# EAGLE design H17R10 (EAGLE 9.6.2)

## Sheet 1 of 2: I/O parts
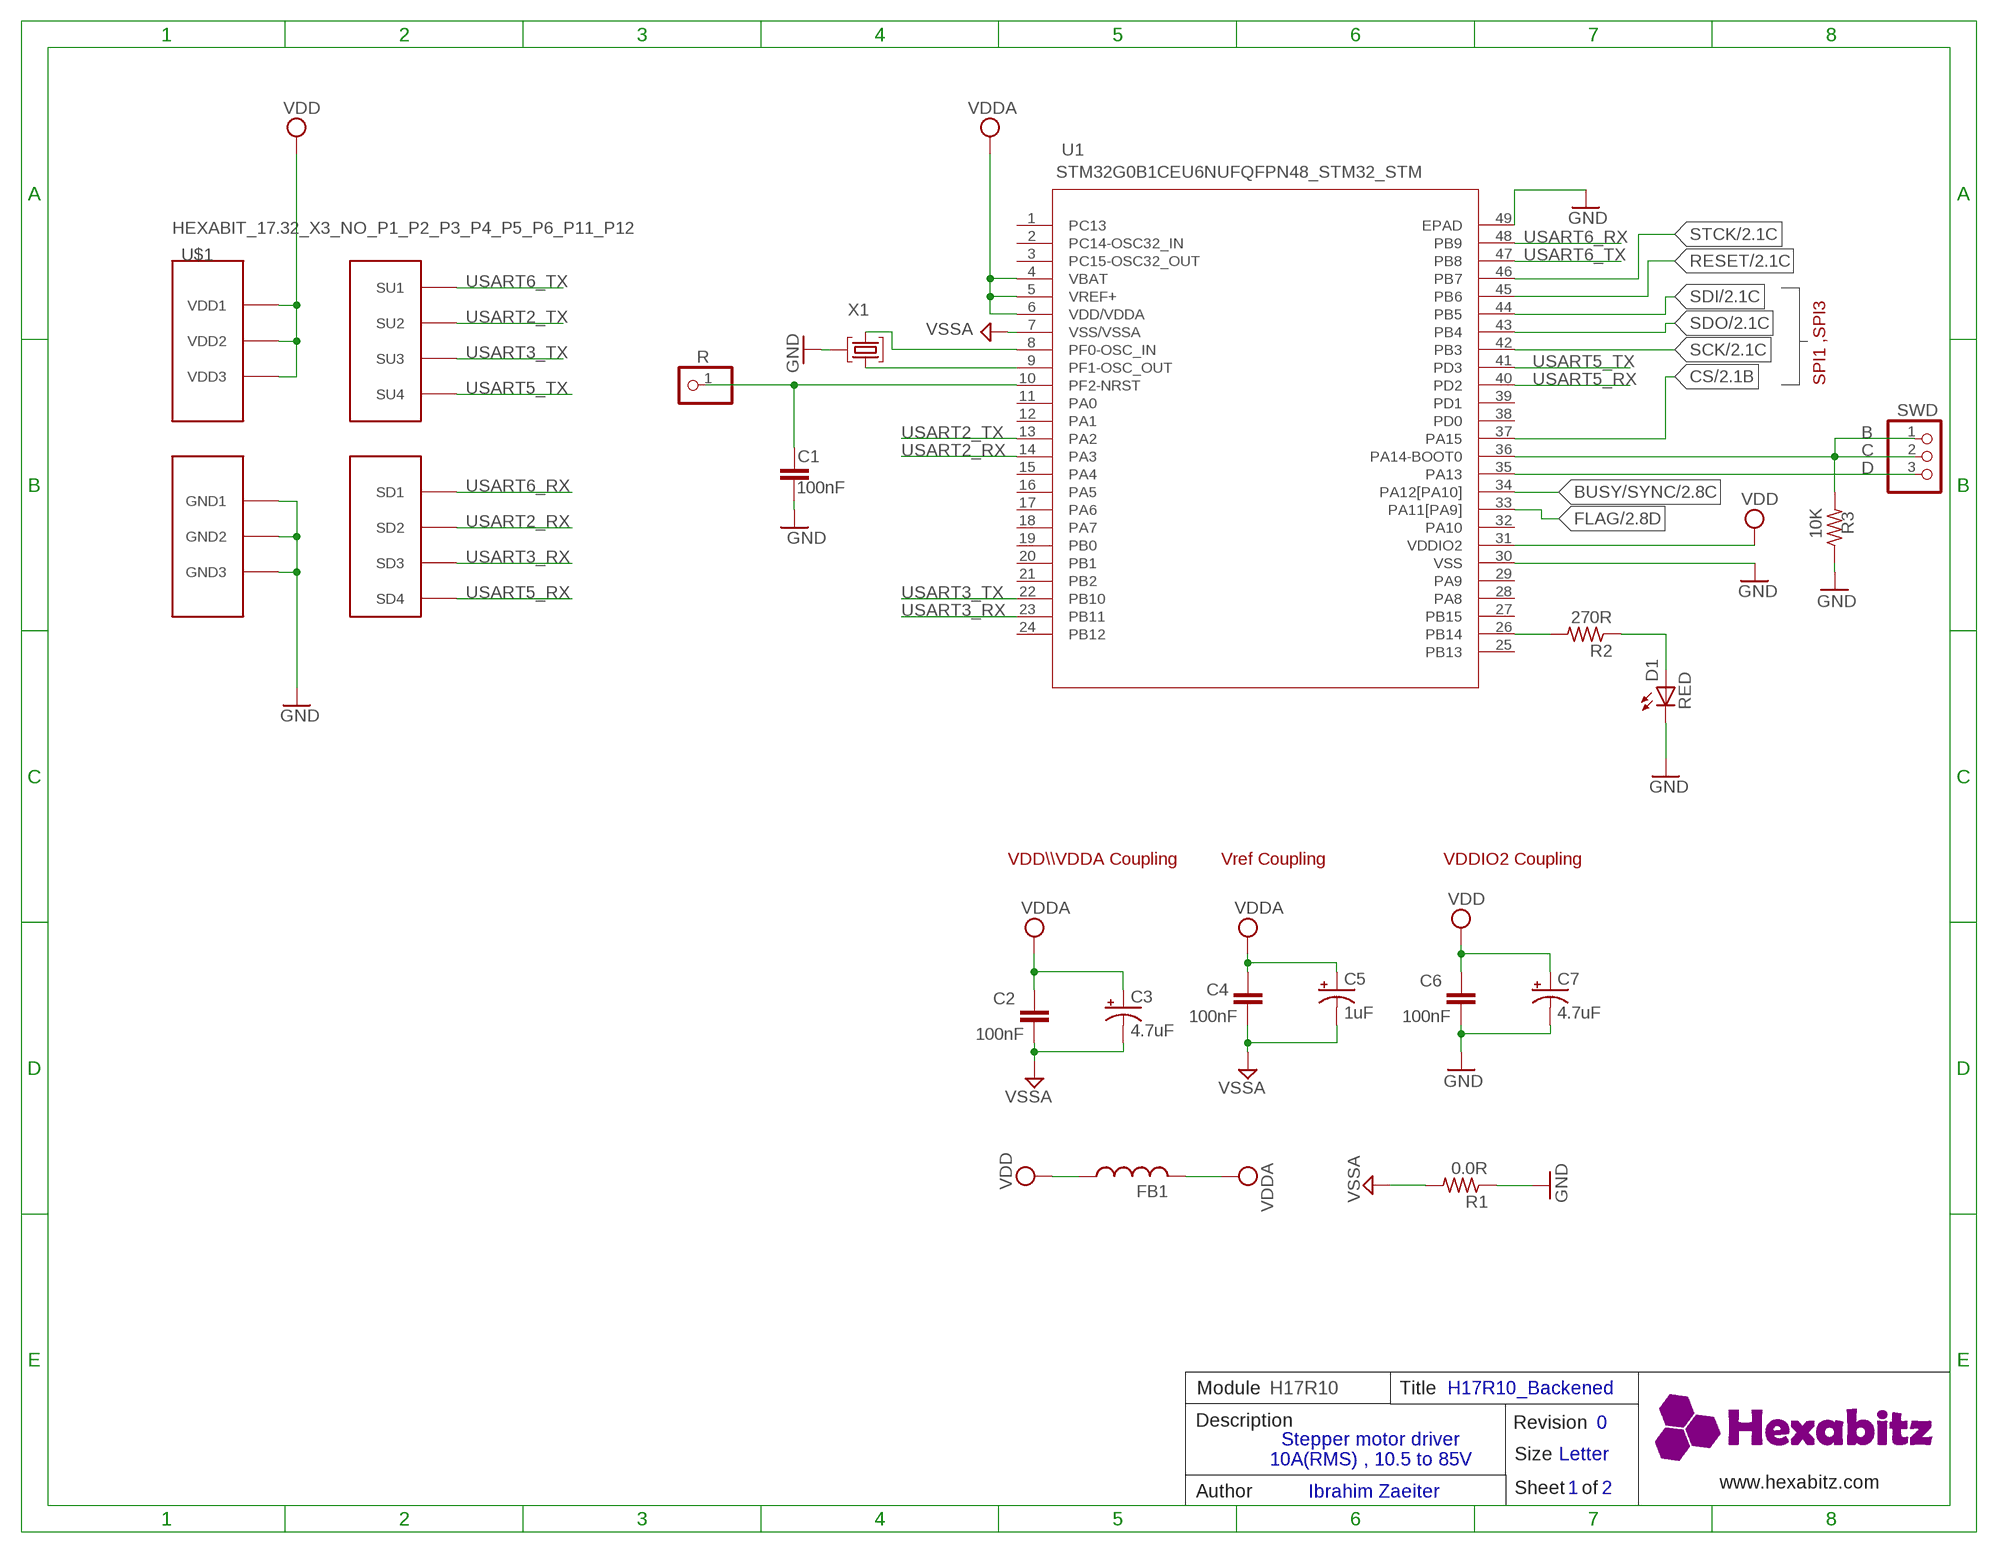
[diagram p0: schematic, sheet 1]

### Parts
C1  100nF  C-0603  [C-0603]
C2  100nF  C-0603  [C-0603]
C3  4.7uF  C-0805-POL  [C-0805-POL]
C4  100nF  C-0603  [C-0603]
C5  1uF  C-0805-POL  [C-0805-POL]
C6  100nF  C-0603  [C-0603]
C7  4.7uF  C-0805-POL  [C-0805-POL]
D1  RED  VLMS1300-GS08  [VLMS1300-GS08]
FB1  FB-TDK_MMZ1608Y300B  [FB-TDK_MMZ1608Y300B]
R  PINHD-1X1  [1X01]
R1  0.0R  R-0603  [R-0603]
R2  270R  R-0603  [R-0603]
R3  10K  R-0603  [R-0603]
SWD  PINHD-1X3  [1X03]
U1  STM32G0B1CEU6NUFQFPN48_STM32_STM  [HEXABITZ_ICS_UFQFPN48_STM32_STM]
U$1  HEXABIT_17.32_X3_NO_P1_P2_P3_P4_P5_P6_P11_P12  [HEXABIT_17.32_X3_NO_P1_P2_P3_P4_P5_P6_P11_P12]
X1  8MHZ  XTALL_CSTCE8M00G52  [XTALL_CSTCE8M00G52]

### Nets
BUSY/SYNC: U1.34(PA12[PA10]) ; also sheet 2
C: R3.2 SWD.1 SWD.2 U1.36(PA14-BOOT0)
CS: U1.37(PA15) ; also sheet 2
D: SWD.3 U1.35(PA13)
FLAG: U1.33(PA11[PA9]) ; also sheet 2
GND: C1.1 C6.1 C7.2(-) D1.C R1.1 R3.1 U1.30(VSS) U1.49(EPAD) U$1.PAD_PD12(GND1) U$1.PAD_PD17(GND2) U$1.PAD_PD19(GND3) X1.P$2
N$1: U1.8(PF0-OSC_IN) X1.P$1
N$2: U1.9(PF1-OSC_OUT) X1.P$3
N$12: C1.2 R.1 U1.10(PF2-NRST)
N$17: R2.2 U1.26(PB14)
N$19: D1.A R2.1
RESET: U1.45(PB6) ; also sheet 2
SCK: U1.42(PB3) ; also sheet 2
SDI: U1.44(PB5) ; also sheet 2
SDO: U1.43(PB4) ; also sheet 2
STCK: U1.46(PB7) ; also sheet 2
USART2_RX: U1.14(PA3) U$1.PAD_PD1(SD2)
USART2_TX: U1.13(PA2) U$1.PAD_PU1(SU2)
USART3_RX: U1.23(PB11) U$1.PAD_PD2(SD3)
USART3_TX: U1.22(PB10) U$1.PAD_PU2(SU3)
USART5_RX: U1.40(PD2) U$1.PAD_PD8(SD4)
USART5_TX: U1.41(PD3) U$1.PAD_PU8(SU4)
USART6_RX: U1.48(PB9) U$1.PAD_PD3(SD1)
USART6_TX: U1.47(PB8) U$1.PAD_PU3(SU1)
VDD: C6.2 C7.1(+) FB1.1 U1.31(VDDIO2) U$1.PAD_PU12(VDD1) U$1.PAD_PU17(VDD2) U$1.PAD_PU19(VDD3)
VDDA: C2.2 C3.1(+) C4.2 C5.1(+) FB1.2 U1.4(VBAT) U1.5(VREF+) U1.6(VDD/VDDA) ; also sheet 2
VSSA: C2.1 C3.2(-) C4.1 C5.2(-) R1.2 U1.7(VSS/VSSA) ; also sheet 2
Unconnected: U1.1(PC13) U1.2(PC14-OSC32_IN) U1.3(PC15-OSC32_OUT) U1.11(PA0) U1.12(PA1) U1.15(PA4) U1.16(PA5) U1.17(PA6) U1.18(PA7) U1.19(PB0) U1.20(PB1) U1.21(PB2) U1.24(PB12) U1.25(PB13) U1.27(PB15) U1.28(PA8) U1.29(PA9) U1.32(PA10) U1.38(PD0) U1.39(PD1)

### Notes on the sheet
- SPI1 ,SPI3
- B
- VDD\\\VDDA Coupling | Vref Coupling | VDDIO2 Coupling
- Module | H17R10 | Title | H17R10_Backened
- Description | Revision | 0
- Stepper motor driver 
  10A(RMS) , 10.5 to 85V
- Size | Letter
- www.hexabitz.com
- Author | Ibrahim Zaeiter | Sheet   of | 1 | 2

## Sheet 2 of 2
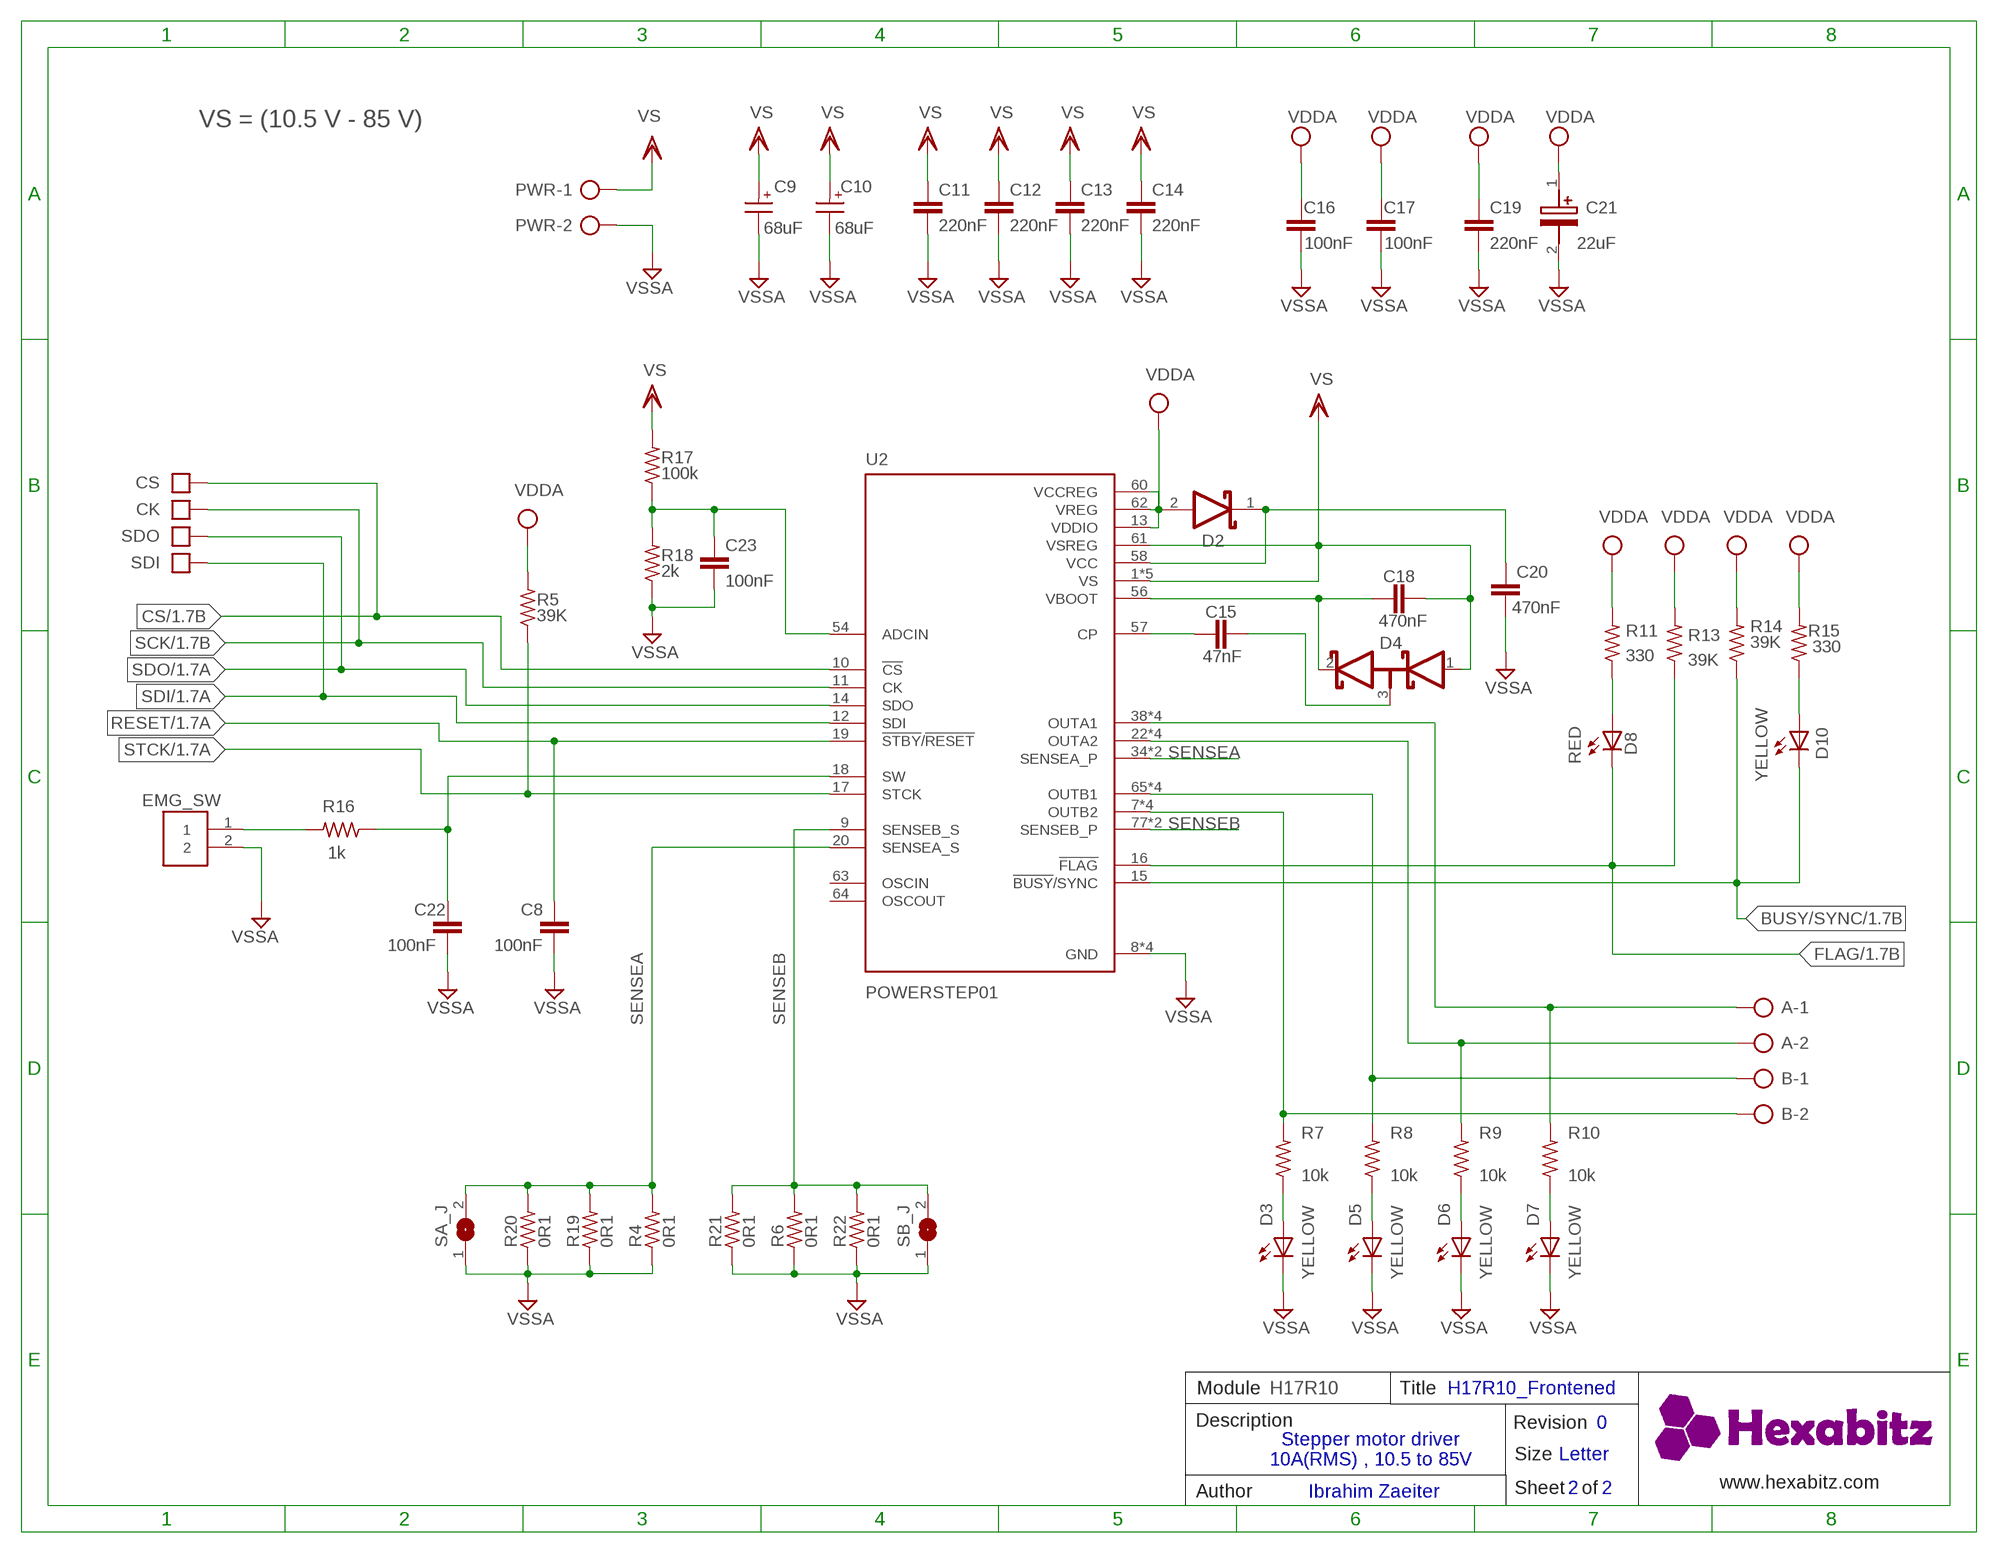
[diagram p1: schematic, sheet 2]

### Parts
A  AK500/2  [AK500/2]
B  AK500/2  [AK500/2]
C8  100nF  C-0603  [C-0603]
C9  68uF  WCAP-ASLI_12.5X14EEVFK2A680Q  [WCAP-ASLI_12.5X14(DXL)]
C10  68uF  WCAP-ASLI_12.5X14EEVFK2A680Q  [WCAP-ASLI_12.5X14(DXL)]
C11  220nF  C-0805  [C-0805]
C12  220nF  C-0805  [C-0805]
C13  220nF  C-0805  [C-0805]
C14  220nF  C-0805  [C-0805]
C15  47nF  C-0805  [C-0805]
C16  100nF  C-0603  [C-0603]
C17  100nF  C-0603  [C-0603]
C18  470nF  C-0603  [C-0603]
C19  220nF  C-0603  [C-0603]
C20  470nF  C-0603  [C-0603]
C21  22uF  T491A226K006AT  [T491A]
C22  100nF  C-0603  [C-0603]
C23  100nF  C-0603  [C-0603]
CK  PAD4  [PAD4]
CS  PAD4  [PAD4]
D2  STMICROELECTRONICS_BAT46ZFILMSTMICROELECTRONICS_BAT46ZFILM_0_3  [STMICROELECTRONICS_BAT46ZFILM_3]
D3  YELLOW  VLMY1300-GS08  [VLMY1300-GS08]
D4  STMICROELECTRONICS_BAR43SFILMSTMICROELECTRONICS_BAR43SFILM_0_0  [STMICROELECTRONICS_BAR43SFILM_0]
D5  YELLOW  VLMY1300-GS08  [VLMY1300-GS08]
D6  YELLOW  VLMY1300-GS08  [VLMY1300-GS08]
D7  YELLOW  VLMY1300-GS08  [VLMY1300-GS08]
D8  RED  VLMS1300-GS08  [VLMS1300-GS08]
D10  YELLOW  VLMY1300-GS08  [VLMY1300-GS08]
EMG_SW  3-644456-2  [TE_3-644456-2]
PWR  AK500/2  [AK500/2]
R4  0R1  R-US_R2512  [R2512]
R5  39K  R-0603  [R-0603]
R6  0R1  R-US_R2512  [R2512]
R7  10k  R-0805  [R-0805]
R8  10k  R-0805  [R-0805]
R9  10k  R-0805  [R-0805]
R10  10k  R-0805  [R-0805]
R11  330  R-0603  [R-0603]
R13  39K  R-0603  [R-0603]
R14  39K  R-0603  [R-0603]
R15  330  R-0603  [R-0603]
R16  1k  R-0603  [R-0603]
R17  100k  R-0603  [R-0603]
R18  2k  R-0603  [R-0603]
R19  0R1  R-US_R2512  [R2512]
R20  0R1  R-US_R2512  [R2512]
R21  0R1  R-US_R2512  [R2512]
R22  0R1  R-US_R2512  [R2512]
SA_J  SJW  [SJW]
SB_J  SJW  [SJW]
SDI  PAD4  [PAD4]
SDO  PAD4  [PAD4]
U2  POWERSTEP01  [IC_POWERSTEP01]

### Nets
BUSY/SYNC: D10.C R14.1 U2.15(!BUSY!/SYNC) ; also sheet 1
CS: CS.P$1 U2.10(!CS) ; also sheet 1
FLAG: D8.C R13.1 U2.16(!FLAG) ; also sheet 1
N$3: C22.1 R16.1 U2.18(SW)
N$4: C15.1 U2.57(CP)
N$5: D10.A R15.1
N$6: D7.A R10.1
N$7: C23.1 R17.1 R18.2 U2.54(ADCIN)
N$10: D3.A R7.1
N$13: D8.A R11.1
N$15: D5.A R8.1
N$16: D6.A R9.1
N$26: C18.2 D4.2(K1) U2.56(VBOOT)
N$27: C20.1 D2.1(CATHODE) U2.58(VCC)
N$32: C15.2 D4.3(A1/K2)
OUTA1: A.2 R10.2 U2.38(OUTA1) U2.42(OUTA1) U2.53(OUTA1) U2.EPAD4(OUTA1)
OUTA2: A.1 R9.2 U2.22(OUTA2) U2.33(OUTA2) U2.37(OUTA2) U2.EPAD3(OUTA2)
OUTB1: B.1 R8.2 U2.65(OUTB1) U2.76(OUTB1) U2.80(OUTB1) U2.EPAD7(OUTB1)
OUTB2: B.2 R7.2 U2.7(OUTB2) U2.81(OUTB2) U2.85(OUTB2) U2.EPAD8(OUTB2)
RESET: C8.1 U2.19(!STBY!/!RESET) ; also sheet 1
SCK: CK.P$1 U2.11(CK) ; also sheet 1
SDI: SDI.P$1 U2.12(SDI) ; also sheet 1
SDO: SDO.P$1 U2.14(SDO) ; also sheet 1
SENSEA: R4.2 R19.2 R20.2 SA_J.2 U2.20(SENSEA_S) U2.34(SENSEA_P) U2.39(SENSEA_P)
SENSEB: R6.2 R21.2 R22.2 SB_J.2 U2.9(SENSEB_S) U2.77(SENSEB_P) U2.82(SENSEB_P)
STCK: R5.1 U2.17(STCK) ; also sheet 1
SW: EMG_SW.1 R16.2
VDDA: C16.2 C17.2 C19.1 C21.1(+) D2.2(ANODE) R5.2 R11.2 R13.2 R14.2 R15.2 U2.13(VDDIO) U2.60(VCCREG) U2.62(VREG) ; also sheet 1
VS: C9.1(+) C10.1(+) C11.1 C12.1 C13.1 C14.1 C18.1 D4.1(A2) PWR.1 R17.2 U2.1(VS) U2.23(VS) U2.43(VS) U2.55(VS) U2.61(VSREG) U2.66(VS)
VSSA: C8.2 C9.2(-) C10.2(-) C11.2 C12.2 C13.2 C14.2 C16.1 C17.1 C19.2 C20.2 C21.2(-) C22.2 C23.2 D3.C D5.C D6.C D7.C EMG_SW.2 PWR.2 R4.1 R6.1 R18.1 R19.1 R20.1 R21.1 R22.1 SA_J.1 SB_J.1 U2.8(GND) U2.21(GND) U2.59(GND) U2.EPAD9(GND) ; also sheet 1
Unconnected: U2.63(OSCIN) U2.64(OSCOUT)

### Notes on the sheet
- VS = (10.5 V - 85 V)
- Module | H17R10 | Title | H17R10_Frontened
- Description | Revision | 0
- Stepper motor driver 
  10A(RMS) , 10.5 to 85V
- Size | Letter
- www.hexabitz.com
- Author | Ibrahim Zaeiter | Sheet   of | 2 | 2

## Library data of the parts
A B PWR = HEXABITZ_CONNECTION_PARTS:AK500/2: CONNECTOR; MFN: TE Connectivity; MPN: 282836-2; OCTOPART_URL: https://octopart.com/282836-2-te+connectivity-39396934?r=sp
C1 = HEXABITZ_RCLS:C-0603: CAP CER 10% X7R 0603; CAPACITANCE: 100nF; MFN: AVX CORPORATION; MPN: 0603YC104K4T2A; OCTOPART_URL: 'https://octopart.com/0603yc104k4t2a-avx+interconnect+%2F+elco-8120651; TOLERANCE: 10%; VOLTAGE_RATING: 16.0 V
C2 C4 C6 C16 C17 = HEXABITZ_RCLS:C-0603: CAP CER 10% X7R 0603; CAPACITANCE: 100nF; MFN: AVX CORPORATION; MPN: '0603YC104K4T2A; OCTOPART_URL: 'https://octopart.com/0603yc104k4t2a-avx+interconnect+%2F+elco-8120651; TOLERANCE: 10%; VOLTAGE_RATING: 16.0 V
C3 = HEXABITZ_RCLS:C-0805-POL: Cap Tant Solid SMD 2012; CAPACITANCE: 4.7uF; MFN: 'Panasonic; MPN: '10TPU4R7MSI; OCTOPART_URL: https://octopart.com/10tpu4r7msi-panasonic-29487748?r=sp; TOLERANCE: 20%; VOLTAGE_RATING: 10.0 V
C5 = HEXABITZ_RCLS:C-0805-POL: Cap Tant Solid SMD 2012; CAPACITANCE: 4.7uF; MFN: 'YAGEO [VA]; MPN: 'CC0805KKX7R7BB105; OCTOPART_URL: 'https://octopart.com/cc0805kkx7r7bb105-yageo-8376555?r=sp; TOLERANCE: 20%; VOLTAGE_RATING: 10.0 V
C7 = HEXABITZ_RCLS:C-0805-POL: Cap Tant Solid SMD 2012; CAPACITANCE: 1.00uF; MFN: 'Panasonic; MPN: '10TPU4R7MSI; OCTOPART_URL: https://octopart.com/10tpu4r7msi-panasonic-29487748?r=sp; TOLERANCE: 10%; VOLTAGE_RATING: 16.0 V
C8 C22 C23 = HEXABITZ_RCLS:C-0603: CAP CER 10% X7R 0603; CAPACITANCE: 100nF; MFN: TDK CORPORATION; MPN: C1608X7R1H104K080AA; OCTOPART_URL: https://octopart.com/c1608x7r1h104k080aa-tdk-25947665?r=sp
C9 C10 = HEXABITZ_RCLS:WCAP-ASLI_12.5X14: WCAP-ASLI Aluminium Electrolytic Capacitors Low Impedance +105 °C Characteristics Low impedance product series Mounting style: V-Chip SMT Capacitance range: 0.1 µF ‒ 6800 µF Capacitance tolerance: ±20 % Voltage range (UR): 6.3 ‒ 100 V(DC) Operating temperature: -55 °C up to +105 °C Endurance: 2000 h @ +105 °C Dimensions (DxL) in mm: 4.0 x 5.5 up to 16.0 x 17.0 Recommended soldering: Reflow soldering Applications Low impedance, especially for filtering applications Input and output capacitor for switched-mode power supply Filtering Smoothing e.g. DC/DC converter, AC/DC converter, satellite receiver, control panel <https://www.we-online.com/catalog/media/o14723v209%20Family_WCAP-ASLI.jpg> Details see: https://www.we-online.com/catalog/en/WCAP-ASLI/ Updated by yingchun,Shan;2020-03-03 2020(C) Würth Elektronik; MFN: Panasonic; MPN: EEVFK2A680Q; OCTOPART_URL: https://octopart.com/eevfk2a680q-panasonic-2421317?r=sp
C11-C14 = HEXABITZ_RCLS:C-0805: CAP CER 10% X7R 0805
C15 = HEXABITZ_RCLS:C-0805: CAP CER 10% X7R 0805; MFN: KEMET; MPN: C0805C473K1RACTU; OCTOPART_URL: https://octopart.com/c0805c473k1ractu-kemet-12557765?r=sp; VOLTAGE_RATING: 100V
C18 C20 = HEXABITZ_RCLS:C-0603: CAP CER 10% X7R 0603; MFN: TDK; MPN: CGA3E3X7R1E474K080AE; OCTOPART_URL: https://octopart.com/search?q=CAP+CER+470nF+25V+X7R+0603&currency=USD&specs=0; VOLTAGE_RATING: 100V
C19 = HEXABITZ_RCLS:C-0603: CAP CER 10% X7R 0603; MFN: TDK; MPN: CGA3E3X7R1V224K080AE; OCTOPART_URL: https://octopart.com/cga3e3x7r1v224k080ae-tdk-68305867?r=sp
C21 = HEXABITZ_RCLS:T491A226K006AT: T491, Tantalum, MnO2 Tantalum, Commercial Grade, 22 uF, 10%, 6.3 VDC, 125C, -55C, 85C, SMD, MnO2, Molded, 6 % , 3 Ohms, 1400 nA, 58.6 mg, 3216, 1.6mm, Height Max = 1.8mm, 2000, 156 Weeks Source: Datasheet <https://content.kemet.com/datasheets/KEM_T2005_T491.pdf>; DESCRIPTION: T491, Tantalum, MnO2 Tantalum, Commercial Grade, 22 uF, 10%, 6.3 VDC, 125C, -55C, 85C, SMD, MnO2, Molded, 6 % , 3 Ohms, 1400 nA, 58.6 mg, 3216, 1.6mm, Height Max = 1.8mm, 2000, 156 Weeks; HEIGHT: 1.8mm; MANUFACTURER_NAME: KEMET; MANUFACTURER_PART_NUMBER: T491A226K006AT; MOUSER_PART_NUMBER: 80-T491A226K006; MOUSER_PRICE-STOCK: https://www.mouser.co.uk/ProductDetail/KEMET/T491A226K006AT/?qs=JDkBW2j1Xl8SBbKDtMTqWA%3D%3D
CK CS SDI SDO = HEXABITZ_CONNECTION_PARTS:PAD4
D1 = HEXABITZ_USER_INTERFACE_PARTS:VLMS1300-GS08: Red 0603 130° Clear 54 mcd 2 V Surface Mount ChipLED ; Octopart Url : http://octopart.com/vlms1300-gs08-vishay-21709201; MFN: Vishay; MPN: VLMS1300-GS08; OCTOPART_URL: https://octopart.com/vlms1300-gs08-vishay-21709201?r=sp&s=0nXJNjGsSbWwqfqWlZv0EA
D2 = HEXABITZ_RCLS:STMICROELECTRONICS_BAT46ZFILM: DIODE SCHOTTKY 100V 150MA SOD123; DESCRIPTION: Small Signal Diode, 100 V, 150 Ma, 1 V, 1 A Rohs Compliant: Yes; MFN: STMicroelectronics; MPN: BAT46ZFILM; OCTOPART_URL: https://octopart.com/bat46zfilm-stmicroelectronics-658190?r=sp
D3 D5-D7 D10 = HEXABITZ_USER_INTERFACE_PARTS:VLMY1300-GS08: Yellow 0603 130° Clear 54 mcd 2 V Surface Mount ChipLED ; Octopart Url : http://octopart.com/vlmy1300-gs08-vishay-21709201; MFN: Lite-On; MPN: LTST-C170YKT; OCTOPART_URL: https://octopart.com/ltst-c170ykt-lite-on-549813?r=sp
D4 = HEXABITZ_RCLS:STMICROELECTRONICS_BAR43SFILM: DIODE ARRAY SCHOTTKY 30V SOT23-3; MFN: STMicroelectronics; MPN: BAR43SFILM; OCTOPART_URL: https://octopart.com/bar43sfilm-stmicroelectronics-39549077?r=sp
D8 = HEXABITZ_USER_INTERFACE_PARTS:VLMS1300-GS08: Red 0603 130° Clear 54 mcd 2 V Surface Mount ChipLED ; Octopart Url : http://octopart.com/vlms1300-gs08-vishay-21709201; MFN: Lite-On; MPN: LTST-C170-EKT; OCTOPART_URL: https://octopart.com/ltst-c170ekt-lite-on-549816?r=sp
EMG_SW = HEXABITZ_USER_INTERFACE_PARTS:3-644456-2; AVAILABILITY: Unavailable; CENTERLINE_PITCH: 2.54 mm[.1 in]; COMMENT: 3-644456-2; DESCRIPTION: Connector Unshrouded Header HDR 2 Position 2.54mm Solder Straight Thru-Hole; EU_ROHS_COMPLIANCE: Compliant; MF: TE Connectivity; MFN: TE Connectivity; MP: 3-644456-2; MPN: 87224-1; NUMBER_OF_POSITIONS: 2; OCTOPART_URL: https://octopart.com/87224-1-te+connectivity-39512011?r=sp; PACKAGE: None; PRICE: None; PRODUCT_TYPE: Connector; TE_PURCHASE_URL: https://www.te.com/usa-en/product-3-644456-2.html?te_bu=Cor&te_type=disp&te_campaign=seda_glo_cor-seda-global-disp-prtnr-fy19-seda-model-bom-cta_sma-317_1&elqCampaignId=32493
FB1 = HEXABITZ_RCLS:FB-TDK_MMZ1608Y300B: Ferrite Beads Multi-Layer 30Ohm 25% 100MHz 1.5A 50mOhm DCR 0603; MFN: TDK; MPN: MMZ1608Y300BTA00; OCTOPART_URL: https://octopart.com/mmz1608y300bta00-tdk-7906990?r=sp
R = HEXABITZ_USER_INTERFACE_PARTS:PINHD-1X1: PIN HEADER; MFN: TE Connectivity; MPN: 87227-1; OCTOPART_URL: https://octopart.com/87227-1-te+connectivity-39512052?r=sp
R1 = HEXABITZ_RCLS:R-0603: Thick Film Resistors - SMD 0603; MFN: YAGEO [VR]; MPN: RC0603JR-070RL; OCTOPART_URL: https://octopart.com/rc0603jr-070rl-yageo-1241539?r=sp; RESISTANCE: 0R
R2 = HEXABITZ_RCLS:R-0603: Thick Film Resistors - SMD 0603; MFN: 'Panasonic; MPN: 'ERJ-3GEYJ271V; OCTOPART_URL: https://octopart.com/erj-3geyj271v-panasonic-55560546?r=sp; RESISTANCE: 270R
R3 = HEXABITZ_RCLS:R-0603: Thick Film Resistors - SMD 0603; MFN: Vishay; MPN: '060300J0103T5E; OCTOPART_URL: https://octopart.com/search?q=060300J0103T5E&currency=USD&specs=0; RESISTANCE: 10K
R4 R6 R19-R22 = HEXABITZ_RCLS:R-US_: RESISTOR, American symbol; MFN: Yageo; MPN: PE2512FKE7W0R1L; OCTOPART_URL: https://octopart.com/pe2512fke7w0r1l-yageo-71384148?r=sp; SPICEPREFIX: R
R5 R13 R14 R17 R18 = HEXABITZ_RCLS:R-0603: Thick Film Resistors - SMD 0603; MFN: Yageo; MPN: RC0603FR-0739KL; OCTOPART_URL: https://octopart.com/rc0603fr-0739kl-yageo-55402883?r=sp; RESISTANCE: 39K
R7-R10 = HEXABITZ_RCLS:R-0805: Thick Film Resistors - SMD 0605; MFN: Panasonic; MPN: ERJ-6GEYJ103V; OCTOPART_URL: https://octopart.com/erj-6geyj103v-panasonic-55422885?r=sp
R11 R15 R16 = HEXABITZ_RCLS:R-0603: Thick Film Resistors - SMD 0603; MFN: Yageo; MPN: RC0603JR-07330RL; OCTOPART_URL: https://octopart.com/rc0603jr-07330rl-yageo-39803615?r=sp; RESISTANCE: 330
SA_J SB_J = jumper:SJ: SMD solder JUMPER
SWD = pinhead:PINHD-1X3: PIN HEADER
U1 = HEXABITZ_ICs:STM32G0B1CEU6N; COPYRIGHT: Copyright (C) 2022 Ultra Librarian. All rights reserved.; MFN: STMicroelectronics; MPN: STM32G0B1CEU6N; OCTOPART_URL: https://octopart.com/stm32g0b1ceu6n-stmicroelectronics-116364672?r=sp
U2 = POWERSTEP01:POWERSTEP01: powerSTEP01 Series 5V 10A System-in-Package Integrating Microstepping Controller Check availability <https://pricing.snapeda.com/parts/POWERSTEP01/STMicroelectronics/view-part?ref=eda>; AVAILABILITY: In Stock; DESCRIPTION: Bipolar Motor Driver Power MOSFET SPI 89-VFQFPN (11x14); MF: STMicroelectronics; MP: POWERSTEP01; PACKAGE: PowerVFQFN-89 STMicroelectronics; PRICE: None; PURCHASE-URL: https://pricing.snapeda.com/search/part/POWERSTEP01/?ref=eda
U$1 = hexabitz_connectors:HEXABIT_17.32_X3_NO_P1_P2_P3_P4_P5_P6_P11_P12
X1 = HEXABITZ_OTHER_PARTS:XTALL_CSTCE8M00G52: MURATA CSTCE8M00G52-R0 RESONATOR, SMD, 8MHZ ; Octopart Url : https://octopart.com/cstce8m00g52-r0-murata-7145559; MFN: Murata; MPN: CSTNE8M00G550000R0; OCTOPART_URL: https://octopart.com/cstne8m00g550000r0-murata-91406934?r=sp

## Board
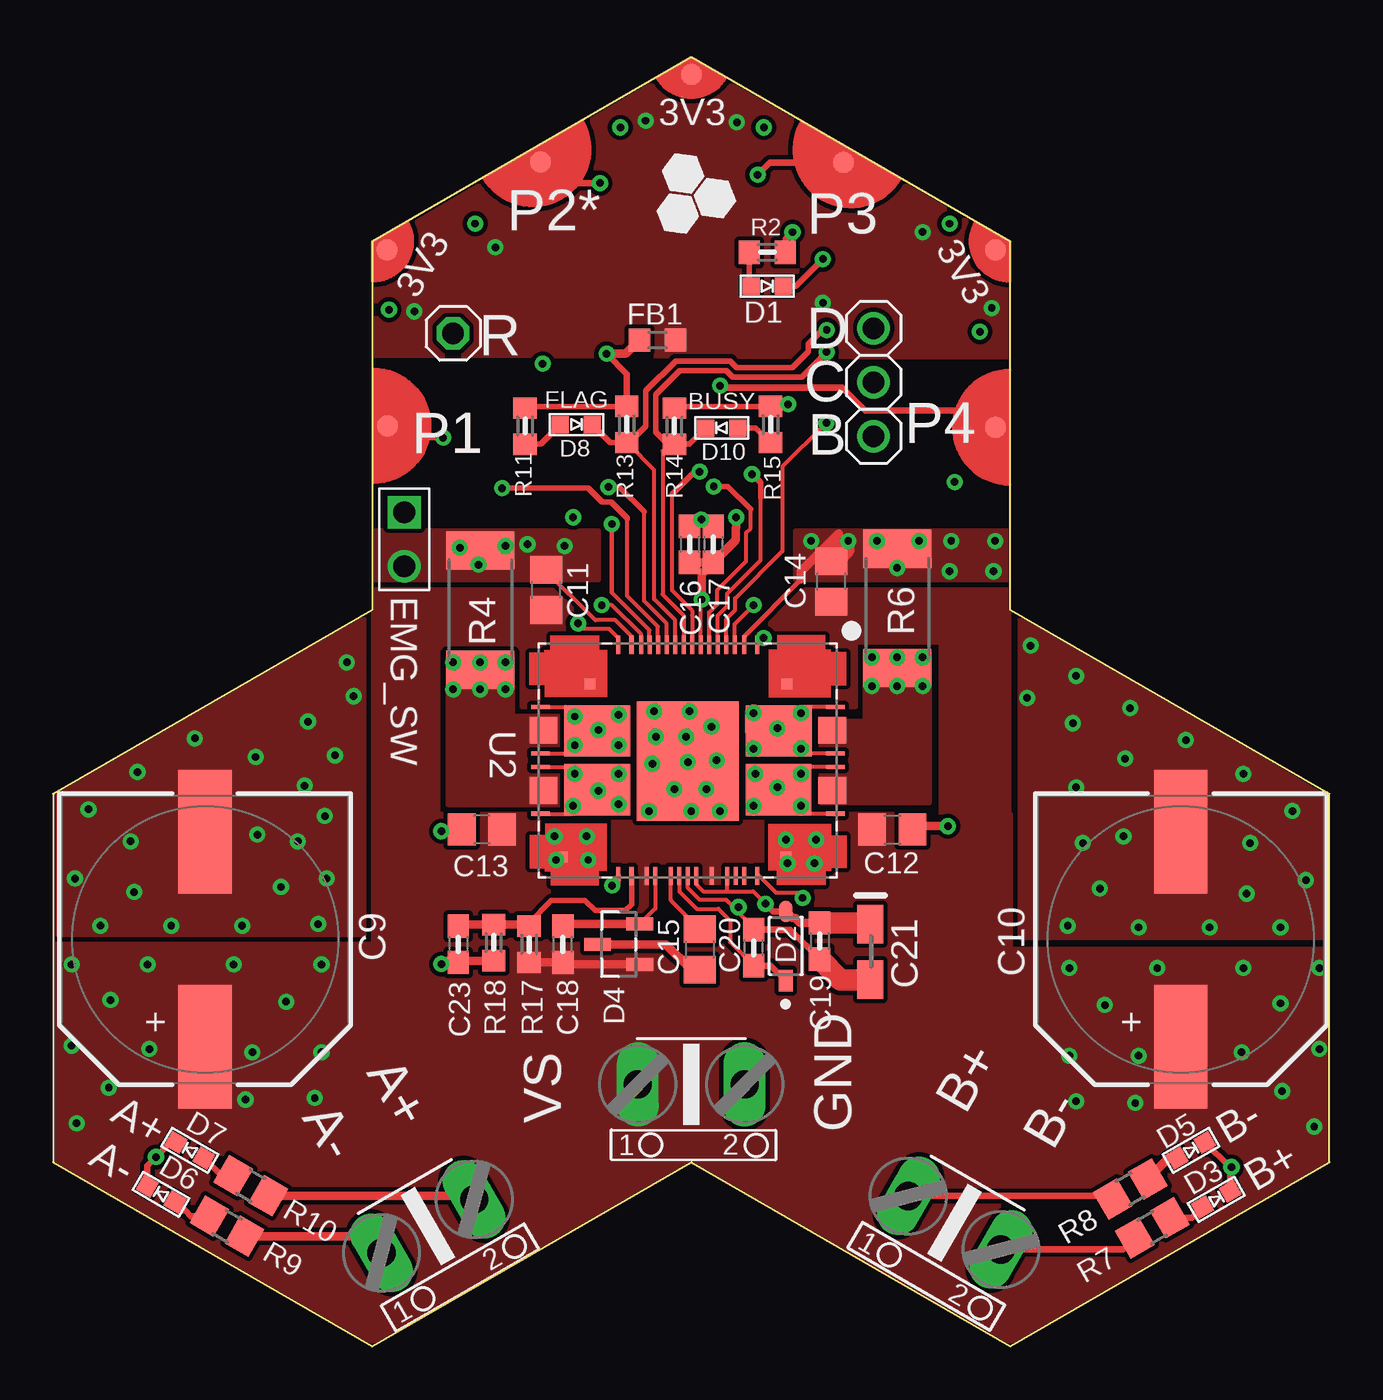
[diagram p2: board, top side]
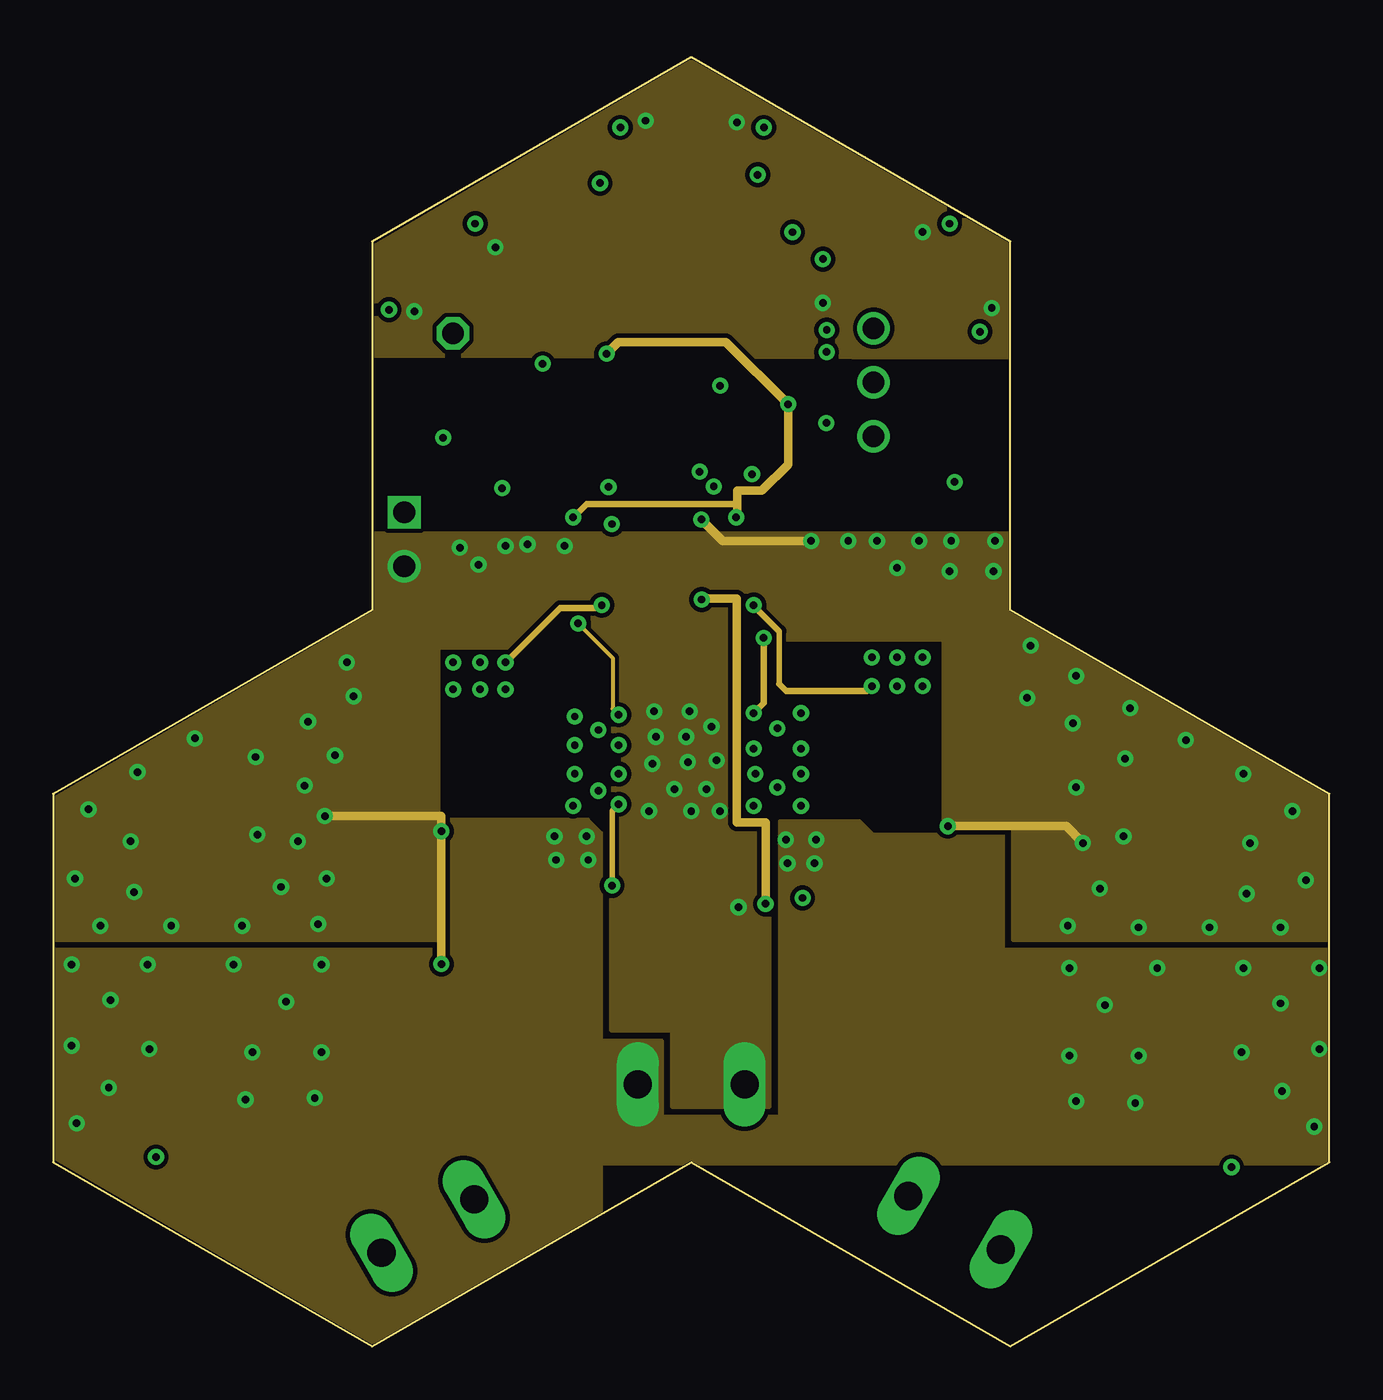
[diagram p3: board, inner layer Route2]
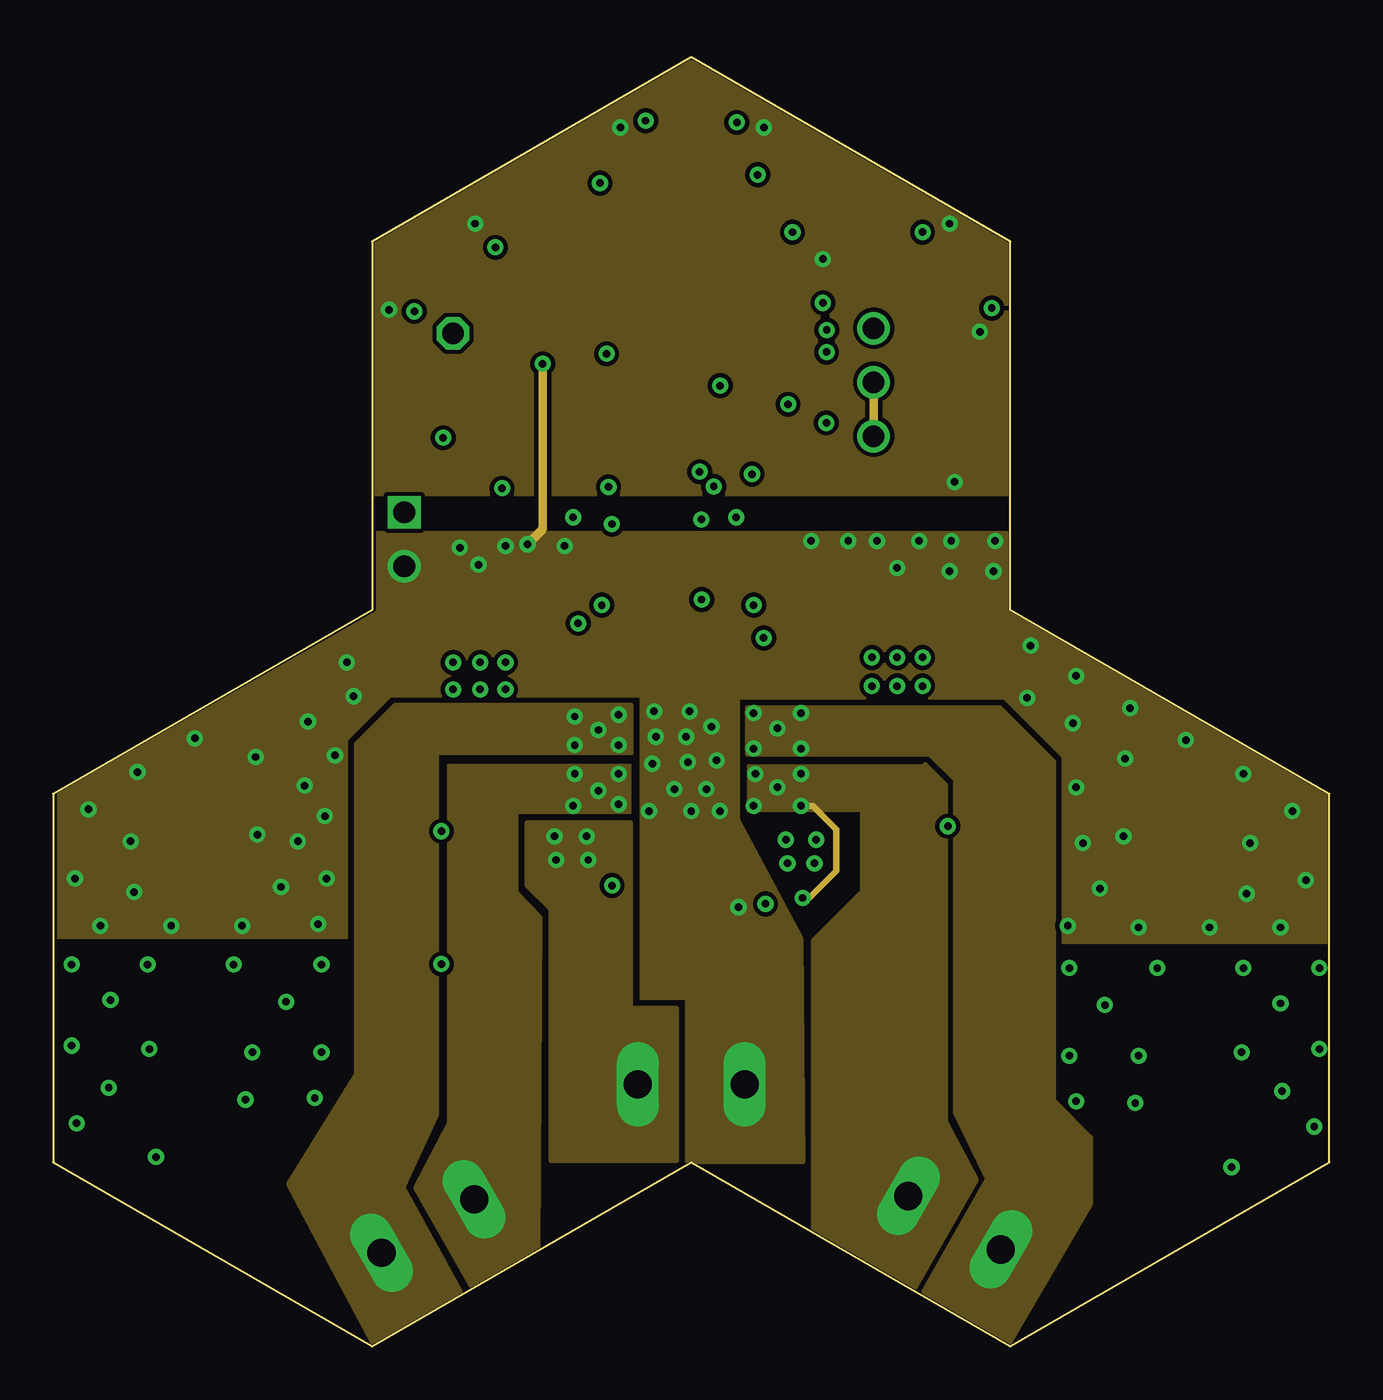
[diagram p4: board, inner layer Route15]
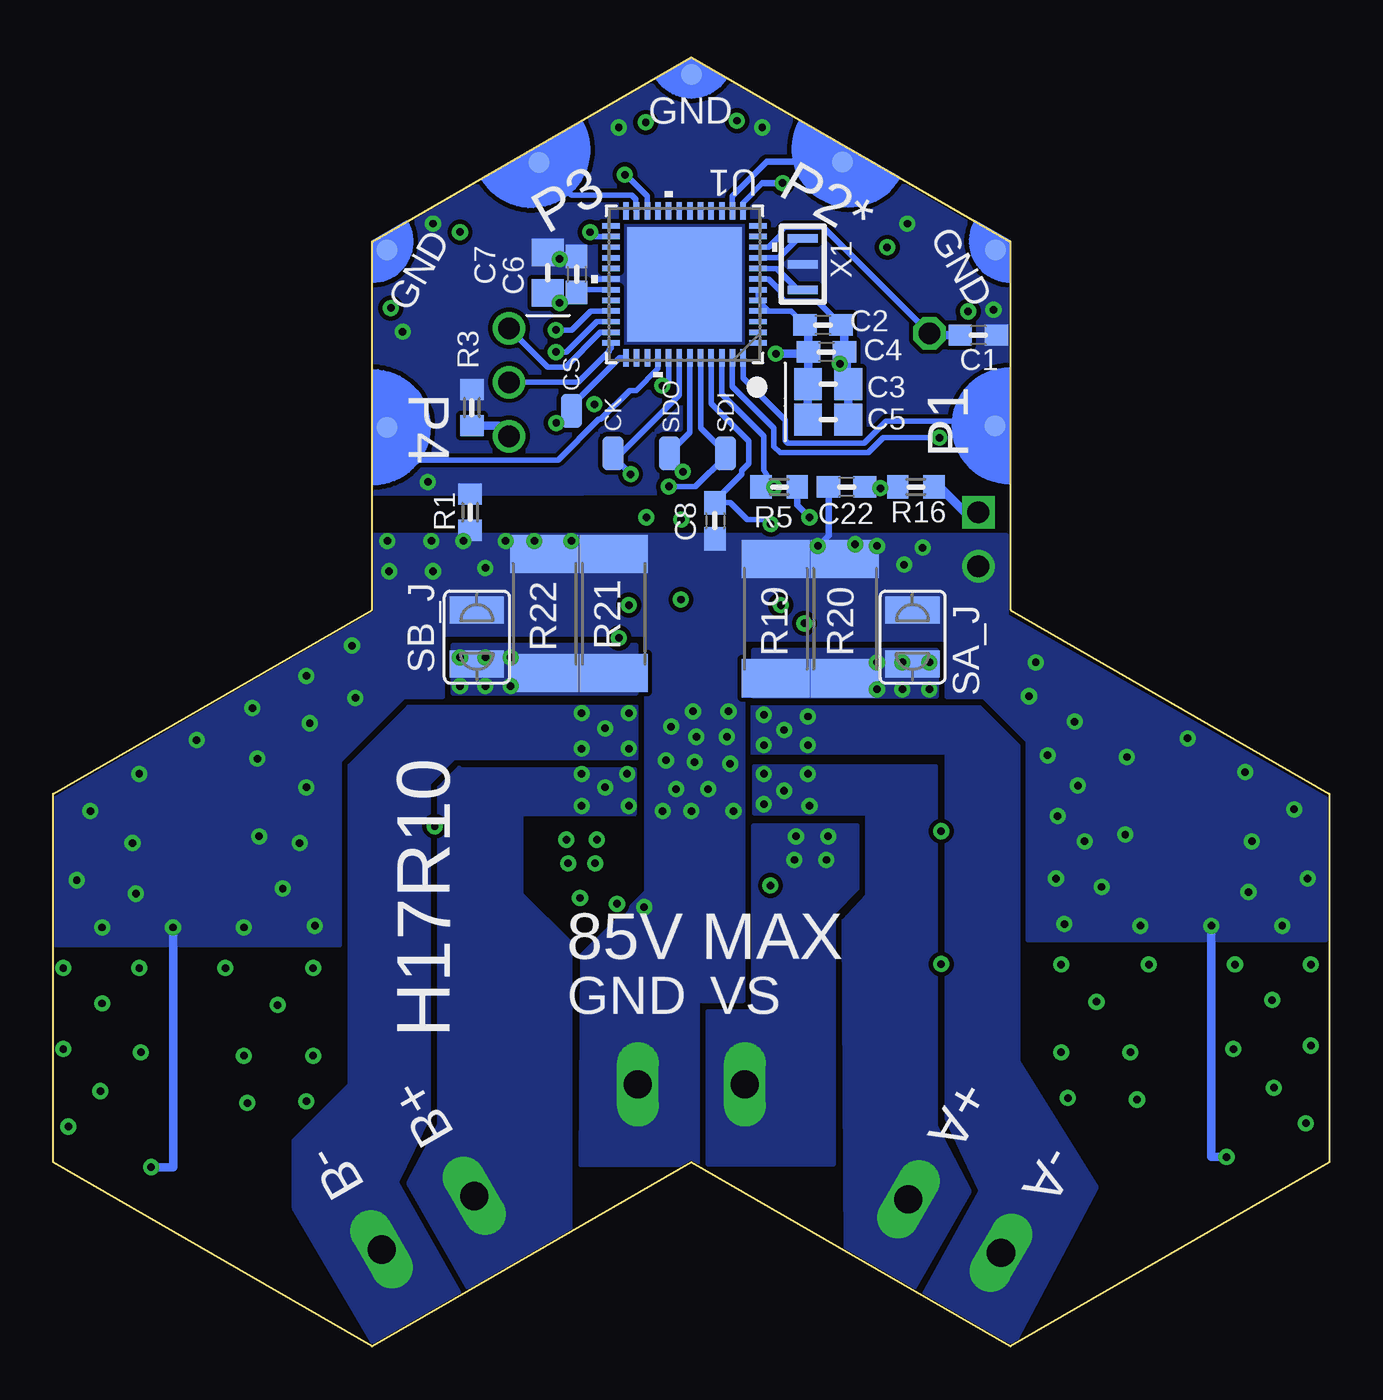
[diagram p5: board, bottom side, seen from below]

Size 60 x 60.62 mm. Coordinates in mm from the lower left corner, seen from the top.
Copper layers (1*2+15*16): Top 0.035mm / dielectric 0.175mm / Route2 0.035mm / dielectric 1.11mm / Route15 0.035mm / dielectric 0.175mm / Bottom 0.035mm
Design rules "4_layer *": minimum track width 7mil, minimum drill 10mil, track to track 8mil, track to pad 8mil, pad to pad 8mil, via to via 8mil, smd to smd 0mil, copper to edge 1mil, drill to drill 8mil, minimum pad ring 10mil, minimum via ring 8mil, stop-mask expansion 2mil, vias tented up to drill 15mil, thermal gap 10mil

### Footprints (pad centres in the part's own frame; a part is rotated, then mirrored left to right if it is on the bottom)
AK500/2 = drill 1.321 long: 1 -2.515,0; 2 2.515,0
C-0603 = smd 1.1 x 1: 1 -0.85,0; 2 0.85,0
C-0805-POL = smd 1.3 x 1.5: 1 -0.95,0; 2 0.95,0
WCAP-ASLI_12.5X14(DXL) = smd 5.8 x 2.5: 1 5.05,0; 2 -5.05,0
C-0805 = smd 1.3 x 1.5: 1 -0.95,0; 2 0.95,0
T491A = smd 1.8 x 1.23: 1 -1.31,0; 2 1.31,0
PAD4 = smd 1.6 x 1: P$1 0,0
VLMS1300-GS08 = smd 0.8 x 0.8: A 0,0.75; C 0,-0.75
STMICROELECTRONICS_BAT46ZFILM_3 = smd 1.006 x 0.641: 1 -1.625,0; 2 1.625,0
VLMY1300-GS08 = smd 0.8 x 0.8: A 0,0.75; C 0,-0.75
STMICROELECTRONICS_BAR43SFILM_0 = smd 1.26 x 0.61: 1 -0.995,0.95; 2 -0.995,-0.95; 3 0.995,0
TE_3-644456-2 = drill 1.02 pad 1.37 square: 1 0,0 | drill 1.02 pad 1.37: 2 2.54,0
FB-TDK_MMZ1608Y300B = smd 1 x 1.1: 1 -0.85,0; 2 0.85,0
1X01 = drill 1.016 octagon: 1 0,0
R-0603 = smd 1 x 1.1: 1 -0.85,0; 2 0.85,0
R2512 = smd 1.8 x 3.2: 1 -2.8,0; 2 2.8,0
R-0805 = smd 1.3 x 1.5: 1 -0.95,0; 2 0.95,0
SJW = smd 1.27 x 2.54: 1 -1.27,0; 2 1.27,0
1X03 = drill 1.016: 1 -2.54,0; 2 0,0; 3 2.54,0
HEXABITZ_ICS_UFQFPN48_STM32_STM = smd 0.813 x 0.254: 1 -3.454,2.751; 2 -3.454,2.251; 3 -3.454,1.75; 4 -3.454,1.25; 5 -3.454,0.75; 6 -3.454,0.25; 7 -3.454,-0.25; 8 -3.454,-0.75; 9 -3.454,-1.25; 10 -3.454,-1.75; 11 -3.454,-2.251; 12 -3.454,-2.751; 25 3.454,-2.751; 26 3.454,-2.251; 27 3.454,-1.75; 28 3.454,-1.25; 29 3.454,-0.75; 30 3.454,-0.25; 31 3.454,0.25; 32 3.454,0.75; 33 3.454,1.25; 34 3.454,1.75; 35 3.454,2.251; 36 3.454,2.751 | smd 0.254 x 0.813: 13 -2.751,-3.454; 14 -2.251,-3.454; 15 -1.75,-3.454; 16 -1.25,-3.454; 17 -0.75,-3.454; 18 -0.25,-3.454; 19 0.25,-3.454; 20 0.75,-3.454; 21 1.25,-3.454; 22 1.75,-3.454; 23 2.251,-3.454; 24 2.751,-3.454; 37 2.751,3.454; 38 2.251,3.454; 39 1.75,3.454; 40 1.25,3.454; 41 0.75,3.454; 42 0.25,3.454; 43 -0.25,3.454; 44 -0.75,3.454; 45 -1.25,3.454; 46 -1.75,3.454; 47 -2.251,3.454; 48 -2.751,3.454 | smd 5.385 x 5.385: 49 0,0
IC_POWERSTEP01 = smd 0.5 x 0.5: 1 -3.6,4.65; 23 -3.6,-4.6; 43 4.55,-5.9; 66 4.55,4.6 | smd 0.86 x 0.19: 7 -5.435,3.27; 8 -5.435,2.65; 9 -5.435,2.2; 10 -5.435,1.8; 11 -5.435,1.4; 12 -5.435,1; 13 -5.435,0.6; 14 -5.435,0.2; 15 -5.435,-0.2; 16 -5.435,-0.6; 17 -5.435,-1; 18 -5.435,-1.4; 19 -5.435,-1.8; 20 -5.435,-2.2; 21 -5.435,-2.65; 22 -5.435,-3.27; 53 5.435,-3.27; 54 5.435,-2.65; 55 5.435,-1.93; 56 5.435,-1.53; 57 5.435,-0.8; 58 5.435,-0.4; 59 5.435,0; 60 5.435,0.4; 61 5.435,1.13; 62 5.435,1.85; 63 5.435,2.25; 64 5.435,2.65; 65 5.435,3.27 | smd 0.19 x 0.86: 33 -2.51,-6.935; 37 -0.32,-6.935; 38 0.32,-6.935; 42 2.51,-6.935; 76 2.51,6.935; 80 0.32,6.935; 81 -0.32,6.935; 85 -2.51,6.935 | smd 1.26 x 1.3: 34 -1.42,-6.79; 39 1.42,-6.79; 77 1.42,6.79; 82 -1.42,6.79 | smd 2.4 x 3.1: EPAD3 -1.38,-4.26; EPAD4 1.38,-4.26; EPAD7 1.38,4.26; EPAD8 -1.38,4.27 | smd 5.6 x 4.8: EPAD9 0.04,0
HEXABIT_17.32_X3_NO_P1_P2_P3_P4_P5_P6_P11_P12 = smd 1 x 1 bottom: PAD_PD1 -21.88,-6.86; PAD_PD2 -21.84,7.39; PAD_PD12 -25.99,0.24 | smd 1 x 1 rotated 240 bottom: PAD_PD3 -9.468,-14.037; PAD_PD8 -9.394,14.542 | smd 1 x 1 rotated 60 bottom: PAD_PD17 -17.741,-14.056 | smd 1 x 1 rotated 300 bottom: PAD_PD19 -17.727,14.55 | smd 1 x 1: PAD_PU1 -21.88,-6.86; PAD_PU2 -21.84,7.39; PAD_PU12 -25.99,0.24 | smd 1 x 1 rotated 240: PAD_PU3 -9.468,-14.037; PAD_PU8 -9.394,14.542 | smd 1 x 1 rotated 60: PAD_PU17 -17.741,-14.056 | smd 1 x 1 rotated 300: PAD_PU19 -17.727,14.55
XTALL_CSTCE8M00G52 = smd 1.4 x 0.4: P$1 0,1.2; P$2 0,0; P$3 0,-1.2

### Placement (x,y rotation side)
A  17.62,5.65 30 top
B  42.38,5.81 330 top
C1  16.5,47.56 180 bottom
C2  23.81,48.04 180 bottom
C3  23.57,45.26 0 bottom
C4  23.65,46.77 180 bottom
C5  23.57,43.59 0 bottom
C6  35.4,50.42 270 bottom
C7  36.75,50.5 90 bottom
C8  28.89,38.83 270 bottom
C9  7.14,19.15 270 top
C10  53.02,19.15 270 top
C11  23.17,35.58 90 top
C12  39.44,24.3 0 top
C13  20.16,24.3 180 top
C14  36.59,35.97 90 top
C15  30.4,18.67 270 top
C16  29.92,37.72 270 top
C17  31.03,37.72 270 top
C18  23.97,18.91 90 top
C19  36.03,19.07 270 top
C20  32.94,18.75 90 top
C21  38.41,18.55 270 top
C22  22.7,40.42 180 bottom
C23  19.04,18.91 270 top
CK  33.68,42.01 90 bottom
CS  35.63,43.99 90 bottom
D1  33.57,49.86 90 top
D2  34.44,18.83 90 top
D3  54.68,6.92 120 top
D4  26.59,18.91 180 top
D5  53.49,9.22 120 top
D6  5.07,7.16 240 top
D7  6.42,9.22 240 top
D8  24.6,43.36 90 top
D10  31.43,43.2 270 top
EMG_SW  16.5,39.23 270 top
FB1  28.41,47.32 180 top
PWR  30,12.32 0 top
R  18.81,47.64 0 top
R1  40.4,39.23 270 bottom
R2  33.57,51.45 0 top
R3  40.32,44.15 270 bottom
R4  20.08,34.62 270 top
R5  25.87,40.42 0 bottom
R6  39.68,34.7 270 top
R7  51.67,5.57 210 top
R8  50.64,7.4 210 top
R9  8.17,5.65 330 top
R10  9.28,7.56 330 top
R11  22.19,43.28 90 top
R13  26.97,43.36 90 top
R14  29.2,43.28 90 top
R15  33.73,43.36 90 top
R16  19.44,40.42 0 bottom
R17  22.38,18.91 270 top
R18  20.71,18.99 90 top
R19  26.03,34.23 270 bottom
R20  22.78,34.23 270 bottom
R21  33.65,34.47 270 bottom
R22  36.9,34.47 270 bottom
SA_J  19.6,33.35 270 bottom
SB_J  40.08,33.35 270 bottom
SDI  28.38,42.01 90 bottom
SDO  31.03,42.01 90 bottom
SWD  38.57,45.34 90 top
U1  30.32,49.94 180 bottom
U2  29.84,27.56 270 top
U$1  29.76,33.83 270 top
X1  24.76,50.9 180 bottom

### Tracks (layer width: path | path; a pad name or v marks a point on that pad's centre or on a via)
BUSY/SYNC  (via drill 0.35)
  Top 0.191: U2.15 29.64,34.38 28.66,35.37 28.66,42.11 28.97,42.43 R14.1
  Top 0.254: v36.36,46.76 35.18,45.58 31.96,45.58 31.65,45.89 29.45,45.89 28.32,44.76 28.32,42.99 28.89,42.43 R14.1 29.91,42.43 D10.C
  Bottom 0.254: U1.34 34.45,48.19 35.89,46.76 v36.36,46.76
C
  Route15 0.406: SWD.1 SWD.2
  Bottom 0.254: U1.36 33.77,46.95 33.85,46.88 33.85,46.8 35.31,45.34 SWD.2
  Bottom 0.406: SWD.1 39.07,43.3 R3.2
CS  (via drill 0.35)
  Top 0.191: U2.10 31.65,34.21 32.07,34.63 32.07,35.18 34.28,37.4 34.28,41.37 v36.35,43.43
  Bottom 0.254: v36.35,43.43 36.2,43.43 CS.P$1 35.26,44.36 35.26,44.6 33.37,46.49 U1.37
D
  Bottom 0.254: U1.35 34.27,47.69 35.91,46.05 36.75,46.05 SWD.3
FLAG  (via drill 0.35)
  Top 0.191: U2.16 29.24,34.15 28.25,35.14 28.25,41.22 27.03,42.45 R13.1
  Top 0.254: v36.37,47.8 36.16,47.8 35.49,47.14 35.49,46.78 34.76,46.04 32.15,46.04 31.84,46.35 29.26,46.35 27.87,44.95 27.87,43.29 27.03,42.45 | D8.C 26.2,42.51 R13.1
  Bottom 0.254: v36.37,47.8 35.61,47.8 34.72,48.69 U1.33
GND  (via drill 0.35)
  Top 0.254: D1.C 34.92,49.86 v36.19,51.13
  Bottom 0.254: U1.30 34.32,50.19
  Bottom 0.406: C7.2 36.57,51.27 C6.1
  other vias: 15.79,48.75 19.84,52.8 26.66,57.33 33.41,57.33 43.57,47.72 42.14,52.8 42.38,40.66
  pour Bottom (no thermals): 45.07,40.1 15.08,40.18 15.08,51.69 30,60.42 45,51.85
  pour Route15: 15.23,40.1 45,40.1 45,40.81 45,51.93 30,60.58 15.08,52.01 15.08,40.1
N$1
  Bottom 0.254: U1.8 25.99,50.69 24.99,49.7 X1.P$1
N$2
  Bottom 0.254: U1.9 25.89,51.19 24.99,52.1 X1.P$3
N$3  (via drill 0.35)
  Top 0.191: U2.18 28.43,33.84 26.98,35.29 26.98,38.91
  Top 0.254: v21.11,40.36 25.17,40.36 25.82,39.71 26.23,39.71 26.98,38.96 26.98,38.91
  Bottom 0.254: R16.1 21.05,40.42 | 21.05,40.42 v21.11,40.36 | C22.1 21.05,40.42
N$4
  Top 0.191: C15.1 29.04,20.98 U2.57
N$5
  Top 0.254: D10.A 33.04,43.2 R15.1
N$6
  Top 0.305: R10.1 7.89,8.03 D7.A
N$7
  Top 0.254: U2.54 27.19,20.78 26.9,20.49 25.48,20.49 25,20.97 23.42,20.97 22.38,19.93 R17.1
  Top 0.406: C23.1 19.12,19.84 R18.2 22.3,19.84 R17.1
N$10
  Top 0.305: D3.A 53.54,6.05 R7.1
N$12
  Bottom 0.254: U1.10 26.36,51.69 25.79,52.27 25.79,52.43 25.6,52.63 23.79,52.63 R.1
  Bottom 0.406: R.1 18.73,47.56 C1.2
N$13
  Top 0.254: R11.1 22.92,42.43 D8.A
N$15
  Top 0.406: R8.1 52.43,8.85 D5.A
N$16
  Top 0.305: D6.A 6.12,6.39 6.21,6.39 6.47,6.13 R9.1
N$17  (via drill 0.35)
  Top 0.254: v34.76,52.4 34.42,52.06 R2.2
  Bottom 0.254: U1.26 34.55,52.19 v34.76,52.4
N$19
  Top 0.254: D1.A 32.72,49.96 R2.1
N$26
  Top 0.191: U2.56 28.31,20.59 D4.2
  Top 0.406: D4.2 24.07,19.86 C18.2
N$27
  Top 0.191: U2.58 29.45,21.39 30.27,20.57 31.27,20.57 31.82,20.02 31.82,19.01 C20.1
  Top 0.305: C20.1 33.75,17.9 D2.1
N$32
  Top 0.406: D4.3 28.81,18.91 30,17.72 C15.2
OUTA1  (via drill 0.35)
  Top 0.191: U2.38 24.52,27.24 25.55,26.21 | 25.55,26.21 U2.EPAD4 | U2.42 24.39,25.05 25.55,26.21
  Top 0.254: U2.53 26.57,21.97 v26.28,21.68
  Top 0.406: R10.2 19.62,7.08 A.2
  Top 0.813: U2.EPAD4 24.52,26.18 v24.52,26.92
  Route2 0.254: v26.28,21.68 26.28,25.19 v26.59,25.5
  other vias: 26.59,26.92 25.63,26.13 24.44,25.42
  pour Bottom (no thermals): 21.74,25.02 27.06,25.02 27.06,27.32 18.49,27.32 18.49,10.35 16.88,7.29 19.63,2.49 22.77,4.37 22.86,20.03 21.74,21.22
  pour Route15 (no thermals): 21.82,25.1 27.14,25.1 27.14,27.32 18.57,27.32 18.57,10.51 16.96,7.45 19.7,2.65 22.84,4.52 22.94,20.19 21.82,21.38
OUTA2  (via drill 0.35)
  Top 0.191: U2.37 24.13,27.88 v24.52,28.27 | U2.33 24.08,30.07 v24.52,29.62 | v24.68,34 v24.69,34 24.93,33.75 26.13,33.75 26.57,33.31 U2.22
  Top 0.406: A.1 14.66,5.18 R9.2
  Top 0.813: U2.EPAD3 25.58,29.7 v26.59,29.7 | U2.EPAD3 26.59,28.94 v26.59,28.27 | U2.EPAD3 25.58,28.27 v24.52,28.27 | U2.EPAD3 24.52,28.94 v24.52,29.62
  Route2 0.191: v26.59,29.7 26.3,29.99 26.3,32.38 v24.68,34
  other vias: 25.63,28.99
  pour Bottom (no thermals): 19.12,2.4 16.43,7.32 18.01,10.73 18.01,27.88 27.14,27.88 27.14,30.1 16.43,30.1 14.6,28.27 14.6,13.41 10.92,7.47 14.92,-0.06
  pour Route15 (no thermals): 19.2,2.56 16.5,7.48 18.09,10.89 18.09,27.88 27.22,27.88 27.22,30.18 16.03,30.18 14.2,28.35 14.2,12.8 11,7.63 15,0.1
OUTB1  (via drill 0.35)
  Top 0.191: U2.76 35.23,25.05 U2.EPAD7 35.16,27.24 U2.80 | U2.65 33.19,22.12 33.99,21.33 34.99,21.33 v35.23,21.09
  Top 0.305: B.1 49.67,7.07 R8.2
  Top 0.813: U2.EPAD7 33.01,26.18 v33.01,26.92
  Route15 0.305: v35.16,25.42 35.71,25.42 36.82,24.31 36.82,22.36 35.55,21.09 v35.23,21.09
  other vias: 35.16,26.92 34.05,26.29 32.94,25.42
  pour Bottom (no thermals): 35.63,5.25 35.63,18.99 37.94,21.29 37.94,25.02 32.62,25.02 32.62,27.16 40.79,27.16 40.91,27.28 41.9,26.29 41.9,10.41 43.35,7.67 40.4,2.48
  pour Route15 (no thermals): 35.71,5.41 35.71,19.15 38.02,21.45 38.02,25.18 32.7,25.18 32.7,27.32 40.87,27.32 40.99,27.44 41.98,26.45 41.98,10.57 43.43,7.83 40.48,2.64
OUTB2  (via drill 0.35)
  Top 0.191: U2.85 35.24,30.07 U2.EPAD8 35.17,27.88 U2.81 | v33.4,33.32 33.4,33.29 U2.7
  Top 0.305: R7.2 50.3,4.55 B.2
  Top 0.813: U2.EPAD8 32.94,28.94 v32.94,29.78
  Route2 0.305: v32.94,29.78 33.4,30.25 v33.4,33.32
  other vias: 35.16,29.78 34.05,29.07 32.94,28.11 35.16,28.11
  pour Bottom (no thermals): 40.77,2.36 43.8,7.72 42.3,10.82 42.3,26.45 41.11,27.64 32.54,27.64 32.54,30.1 43.33,30.1 46.11,27.32 46.11,12.32 48.73,9.7 48.73,6.53 44.89,-0.04
  pour Route15 (no thermals): 40.85,2.52 43.88,7.88 42.38,10.97 42.38,26.61 41.19,27.8 32.62,27.8 32.62,30.1 44.52,30.1 47.06,27.56 47.06,11.61 48.81,9.86 48.81,6.68 44.97,0.12
RESET  (via drill 0.35)
  Top 0.191: U2.19 28.03,33.69 26.27,35.45
  Top 0.203: v26.27,38.67 26.27,35.45
  Bottom 0.254: U1.45 29.07,44.35 27.3,42.58 27.3,41.51 27.62,41.19 27.62,41.03 28.89,39.76 C8.1 28.17,39.68 27.38,38.89 26.48,38.89 v26.27,38.67
SCK  (via drill 0.35)
  Top 0.191: U2.11 31.24,34.36 31.67,34.79 31.67,35.39 33.26,36.97 33.26,39.91
  Top 0.254: 33.26,39.91 33.26,40.62 v32.86,41.02
  Bottom 0.254: U1.42 30.57,44.73 33.29,42.01 CK.P$1 33.68,41.84 v32.86,41.02
SDI  (via drill 0.35)
  Top 0.191: U2.12 30.84,34.52 31.23,34.9 31.23,35.57 32.58,36.93 32.58,38.27 32.79,38.47 32.79,39.37
  Top 0.254: 32.79,39.37 31.73,40.44 v31.06,40.44
  Bottom 0.191: 28.38,41.85 SDI.P$1
  Bottom 0.254: U1.44 29.57,43.19 SDI.P$1 | v31.06,40.44 30.7,40.44 30.69,40.42 29.81,40.42 28.38,41.85
SDO  (via drill 0.35)
  Top 0.191: 29.1,40.08 29.1,35.55 30.04,34.62 30.04,34.38 U2.14
  Top 0.254: 29.1,40.08 30.15,41.13 v30.4,41.13
  Bottom 0.254: U1.43 30.07,42.97 SDO.P$1 31.03,41.77 v30.4,41.13
SENSEA  (via drill 0.35)
  Top 0.191: v25.79,34.86 26.27,34.86 27.64,33.49 U2.20
  Route2 0.305: v25.79,34.86 25.66,34.74 23.84,34.74 v21.27,32.16
  other vias: 18.81,30.89 20.08,30.89 21.27,30.89 20.08,32.16 18.81,32.16
  pour Top (no thermals): 21.58,29.62 23.81,29.62 23.81,25.5 18.57,25.5 18.57,32.4 21.58,32.4
  pour Bottom (no thermals): 18.49,30.58 18.49,32.72 27.06,32.72 27.06,30.58
SENSEB  (via drill 0.35)
  Top 0.191: U2.9 32.04,33.97 v32.93,34.86 v32.94,34.86
  Route2 0.254: 34.14,31.15 34.14,33.62 32.94,34.82
  Route2 0.305: v38.49,31.05 38.25,30.81 34.48,30.81 34.14,31.15 | 32.94,34.82 v32.94,34.86
  other vias: 40.87,32.4 39.68,32.4 38.49,32.4 39.68,31.05 40.87,31.05
  pour Top (no thermals): 36.11,25.57 41.19,25.57 41.19,32.64 38.17,32.64 38.17,29.39 36.11,29.39
  pour Bottom (no thermals): 32.62,30.73 32.62,32.96 41.19,32.96 41.19,30.73
STCK  (via drill 0.35)
  Top 0.191: U2.17 28.84,33.99 27.78,35.05 27.78,39.26
  Top 0.254: 27.78,39.26 26.63,40.42 v26.11,40.42
  Bottom 0.191: 26.96,40.66 26.82,40.66 v26.11,40.42
  Bottom 0.254: U1.46 28.57,44.78 26.59,42.8 26.59,41.21 v26.11,40.42
  Bottom 0.305: R5.1 26.96,40.66
SW
  Bottom 0.406: EMG_SW.1 17.14,39.23 18.33,40.42 R16.2
USART2_RX
  Bottom 0.254: U1.14 28.07,54.1 26.55,55.61
  Bottom 0.305: 26.55,55.61 26.45,55.71 U$1.PAD_PD1
USART2_TX  (via drill 0.35)
  Top 0.305: v25.71,54.71 23.9,54.71 U$1.PAD_PU1
  Bottom 0.254: U1.13 27.57,53.79 26.65,54.71
  Bottom 0.305: 26.65,54.71 v25.71,54.71
USART3_RX
  Bottom 0.254: U1.23 32.61,53.44 32.61,53.94 32.8,54.13 35.61,54.13 U$1.PAD_PD2
USART3_TX  (via drill 0.35)
  Top 0.305: v33.12,55.1 33.69,55.67 U$1.PAD_PU2
  Bottom 0.254: v33.12,55.1 33.08,55.1 32.07,54.09 U1.22
USART5_RX
  Bottom 0.254: U$1.PAD_PD8 42.77,41.69 36.26,41.69 34.35,43.6 34.26,43.6 32.9,44.96 32.6,44.96 31.57,45.99 U1.40
USART5_TX  (via drill 0.35)
  Top 0.305: v31.36,45.18 31.44,45.1 37.11,45.1 38.19,44.02 43.51,44.02 U$1.PAD_PU8
  Bottom 0.254: U1.41 31.07,45.39 31.32,45.14 v31.36,45.18
USART6_RX
  Bottom 0.254: U1.48 27.57,45.54 25.58,43.55 25.58,42.59 25.47,42.48 21.86,42.48 20.83,43.52 15.94,43.52
  Bottom 0.305: 15.94,43.52 U$1.PAD_PD3
USART6_TX  (via drill 0.35)
  Top 0.254: U$1.PAD_PU3 15.9,43.48 16.65,42.73 v18.33,42.73
  Bottom 0.254: U1.47 28.07,45.14 26.12,43.19 26.12,42.32 25.82,42.03 21.67,42.03 20.97,42.73 v18.33,42.73
VDD  (via drill 0.35)
  Bottom 0.254: U1.31 35.27,49.69 C6.2
  Bottom 0.305: C6.2 35.89,49.07 v36.19,49.07 36.67,49.55 C7.1
  other vias: 27.86,57.64 32.14,57.56 44.13,48.83 40.87,52.4 20.79,51.69 16.98,48.67
  pour Top (no thermals): 45.03,46.53 15.08,46.61 15.08,51.69 30,60.42 45,51.85
  pour Route2 (no thermals): 45.03,46.53 15.08,46.61 15.08,51.69 30,60.42 45,51.85
VDDA  (via drill 0.35)
  Top 0.191: U2.60 30.24,21.71 30.56,21.4 31.69,21.4 | 31.69,21.4 U2.62 | v33.49,20.81 32.91,21.4 32.89,21.4 31.69,21.4 | U2.13 30.44,35.07 v30.49,35.12
  Top 0.254: R15.2 29.28,44.21 R14.2 | R11.2 22.27,44.21 R13.2
  Top 0.305: D2.2 33.85,20.45 v33.49,20.81 | R13.2 26.97,45.73 v26.02,46.68
  Top 0.406: FB1.2 26.92,46.68 v26.02,46.68 | C19.1 35.12,19.92 34.88,20.15 34.74,20.15 D2.2 | R15.2 34.45,44.21 v34.55,44.31 | v30.49,35.12 30.49,36.33 C17.2 | C16.2 C17.2 | v32.11,38.99 32.11,38.5 32.08,38.47 32.08,37.92 C17.2
  Top 1.016: C19.1 38.36,19.92 C21.1
  Route2 0.305: v24.44,38.99 25.08,39.62 32.16,39.62
  Route2 0.406: v33.49,20.81 33.49,24.63 32.14,24.63 32.14,35.18 30.54,35.18 v30.49,35.12 | v32.11,38.99 32.16,39.04 32.16,39.62 32.16,40.24 33.32,40.24 34.55,41.47 v34.55,44.31 31.62,47.24 26.58,47.24 v26.02,46.68
  Bottom 0.254: U1.4 26.36,48.69 | 26.36,48.69 25.31,48.69 C2.2 | 26.36,48.69 U1.5 U1.6
  Bottom 0.305: R5.2 25.02,39.57 v24.44,38.99
  Bottom 0.406: C2.2 24.5,47.88 C4.2 | C4.2 24.5,45.28 C3.1 C5.1 | v26.02,46.68 24.59,46.68 C4.2
VS  (via drill 0.35)
  Top 0.406: D4.1 24.07,17.96 C18.1 R17.2
  Top 1.27: 34.84,31.77 35,31.93 | 24.84,31.93 24.92,31.85 | 24.51,23.02 24.68,23.19
  other vias: 34.44,23.83 35.87,23.83 35.79,22.72 34.52,22.72 23.57,23.99 25.08,23.99 25.16,22.88 23.65,22.88 48.1,11.53 50.87,11.45 51.03,13.67 47.78,13.67 49.45,16.05 47.78,17.8 55.87,13.83 57.78,12 59.29,10.34 59.53,13.99 51.91,17.8 59.53,17.8 57.7,16.13 55.95,17.8 0.87,17.95 0.87,14.14 2.69,16.29 4.44,17.95 8.49,17.95 10.95,16.21 9.36,13.83 12.62,17.95 12.62,13.83 12.3,11.68 9.04,11.61 2.61,12.16 1.11,10.49 4.52,13.99
  pour Route2 (no thermals): 25.79,6.35 25.79,24.15 25.16,24.78 18.57,24.78 18.57,18.67 0.07,18.67 0,8.88 15.09,0.13
  pour Route2 (no thermals): 34.13,24.7 34.13,10.81 28.65,10.81 28.65,14.38 25,14.38 25,8.59 60.08,8.59 60.08,18.67 44.68,18.67 44.68,24.07 38.57,24.07 37.94,24.7
  pour Top (no thermals): 30.08,8.51 45,-0.06 60.08,8.59 60,18.67 45,18.67 45,25.02 15.08,25.02 15.08,18.91 0.07,18.91 0.07,8.59 15.08,-0.14
  pour Top (no thermals): 15.08,23.67 15.08,35.58 44.92,35.58 44.92,24.54 41.75,24.54 41.75,33.12 37.7,33.12 37.7,30.1 22.06,30.1 22.06,32.88 18.09,32.88 18.09,23.67
  pour Bottom (no thermals): 29.2,8.59 29.2,15.73 27.06,15.73 27.06,24.46 22.22,24.46 22.22,21.53 23.33,20.42 23.33,8.59
  pour Route15 (no thermals): 29.28,8.75 29.28,15.89 27.14,15.89 27.14,24.62 22.3,24.62 22.3,21.69 23.41,20.57 23.41,8.75
VSSA  (via drill 0.35)
  Top 0.191: U2.8 32.49,33.39 | C11.2 23.17,36.45 24.22,35.4 24.22,35.42 25.49,34.15 26.43,34.15 27.19,33.39 U2.21 | C20.2 32.94,19.7 32.1,20.54 31.63,21 30.39,21 29.84,21.56 U2.59
  Top 0.203: 32.49,33.39 35.16,36.06
  Top 0.254: U2.EPAD9 29.72,27.4 v28.17,27.4
  Top 0.305: D3.C 55.33,8.37 | 55.33,8.37 55.33,8.41 D5.C | 55.33,8.37 v55.4,8.43 | D6.C 4.43,8.5 v4.84,8.91 5.53,9.6 D7.C | C20.2 34.16,19.6 34.16,19.59 34.65,19.59 C19.2 36.13,18.12
  Top 0.406: 35.16,36.06 35.16,36.45 36.94,38.23 | C23.2 18.97,17.98 v18.25,17.98 18.41,18.14 R18.1 | C12.2 40.55,24.46 v42.06,24.46 | v32.22,20.65 32.1,20.54 | C17.1 30.79,38.57 v30.47,38.89 30.16,38.57 C16.1
  Top 0.508: C13.2 19.13,24.23 v18.25,24.23
  Top 0.61: C14.2 36.31,36.92 36.31,37.33 | C11.2 23.41,36.77
  Top 1.016: C14.2 37.17,37.5 | C19.2 37.01,17.24 C21.2
  Route2 0.406: v48.41,23.67 47.62,24.46 v42.06,24.46 | v12.77,24.94 18.25,24.94 v18.25,24.23 v18.25,17.98 | v30.47,38.89 31.48,37.88 v35.63,37.88
  Route15 0.406: v23.01,46.21 23.01,38.43 v22.3,37.72
  Bottom 0.254: U1.7 26.36,50.19 25.79,49.62 25.79,49.36 25.6,49.17 24.08,49.17 C2.1
  Bottom 0.305: C22.2 23.55,38.14 v24.05,37.64
  Bottom 0.406: C3.2 22.7,45.34 22.7,46.67 C4.1 22.8,47.88 C2.1 | 21.13,37.78 v21.27,37.64 | v4.84,8.91 5.55,8.91 v5.55,19.78 | v55.4,8.43 54.37,8.43 v54.37,19.7 | v40.71,37.88 40.4,38.2 R1.2 | C3.2 C5.2 | v23.01,46.21 22.62,45.82 C3.2
  other vias: 28.25,29.86 29.92,29.86 30.95,29.15 29.76,28.67 28.33,28.67 31.19,27.56 30.71,26.21 29.2,26.21 28.01,25.18 30,25.18 31.35,25.18 45.95,32.96 48.1,31.53 50.64,30.02 53.26,28.51 55.95,26.92 58.26,25.18 58.89,21.92 57.7,19.7 51.03,19.7 47.7,19.78 45.79,30.5 47.94,29.31 48.1,26.29 50.4,27.64 49.21,21.53 56.11,21.29 56.27,23.67 50.32,23.99 6.66,28.59 3.96,27 1.66,25.26 1.03,22 2.22,19.78 8.88,19.78 12.46,19.86 12.85,22 13.25,27.8 14.12,30.58 11.98,29.39 11.82,26.37 9.52,27.72 11.5,23.75 10.71,21.61 3.8,21.37 3.65,23.75 9.6,24.07 19.12,37.56 13.81,32.16 20,36.77 44.29,37.88 42.22,37.88 42.14,36.45 44.21,36.45 38.73,37.88 39.68,36.61 37.38,37.88 29.84,27.48
  pour Bottom (no thermals): 18.01,33.2 27.54,33.2 27.54,16.21 29.68,16.21 29.68,8.5 35.23,8.5 35.14,18.47 32.12,21.45 32.14,21.45 32.14,33.43 41.67,33.43 41.67,30.5 43.49,30.5 46.51,27.48 46.51,18.83 59.92,18.83 59.92,25.79 45.16,34.39 45.16,38.2 15.16,38.2 15.16,34.39 0.15,25.81 0.15,19.07 14.2,19.07 14.2,28.43 16.27,30.5 18.01,30.5
  pour Route2 (no thermals): 29.12,11.29 29.12,14.88 26.27,14.88 26.27,30.26 22.3,30.26 22.3,32.88 18.09,32.87 18.09,19.15 0.07,19.15 0.07,25.73 15.08,34.47 15.08,38.2 45.08,38.2 45.08,34.54 60.08,25.89 60.08,19.15 45.16,19.15 45.16,24.54 41.9,24.54 41.9,33.27 33.65,33.27 33.65,11.29
  pour Top (no thermals): 45.48,19.23 59.84,19.23 59.84,25.81 45.48,34.29
  pour Top (no thermals): 14.6,19.38 0.23,19.38 0.23,25.97 14.6,34.45
  pour Top (no thermals): 15.08,38.35 15.08,36.05 25.63,36.05 25.63,38.35
  pour Top (no thermals): 36.59,38.35 44.84,38.35 44.92,38.27 44.92,36.05 34.92,36.05 34.92,38.34 36.6,38.34
  pour Route15 (no thermals): 27.62,30.58 27.62,16.37 29.76,16.37 29.76,8.66 35.31,8.66 35.22,19.18 32.22,24.78 32.22,30.5 44.68,30.5 47.46,27.72 47.46,18.99 60,18.99 60,25.95 45.24,34.54 45.24,38.27 15.23,38.27 15.23,34.54 0.23,25.97 0.23,19.23 13.81,19.23 13.81,28.51 15.87,30.58

### Text on the board
tPlace: 3V3 | P2* | P3 | 3V3 | 3V3 | R | D | C | FLAG | BUSY | P4 | P1 | B | B+ | B- | A+ | A+ | VS | A- | GND | B- | A- | B+
bPlace: GND | P2* | P3 | GND | GND | P1 | P4 | 85V MAX | VS | GND | H17R10 | A+ | B+ | A- | B-
tNames: EMG_SW